# EAGLE schematic JD-T1800 Display Breakout (EAGLE 9.2.2)
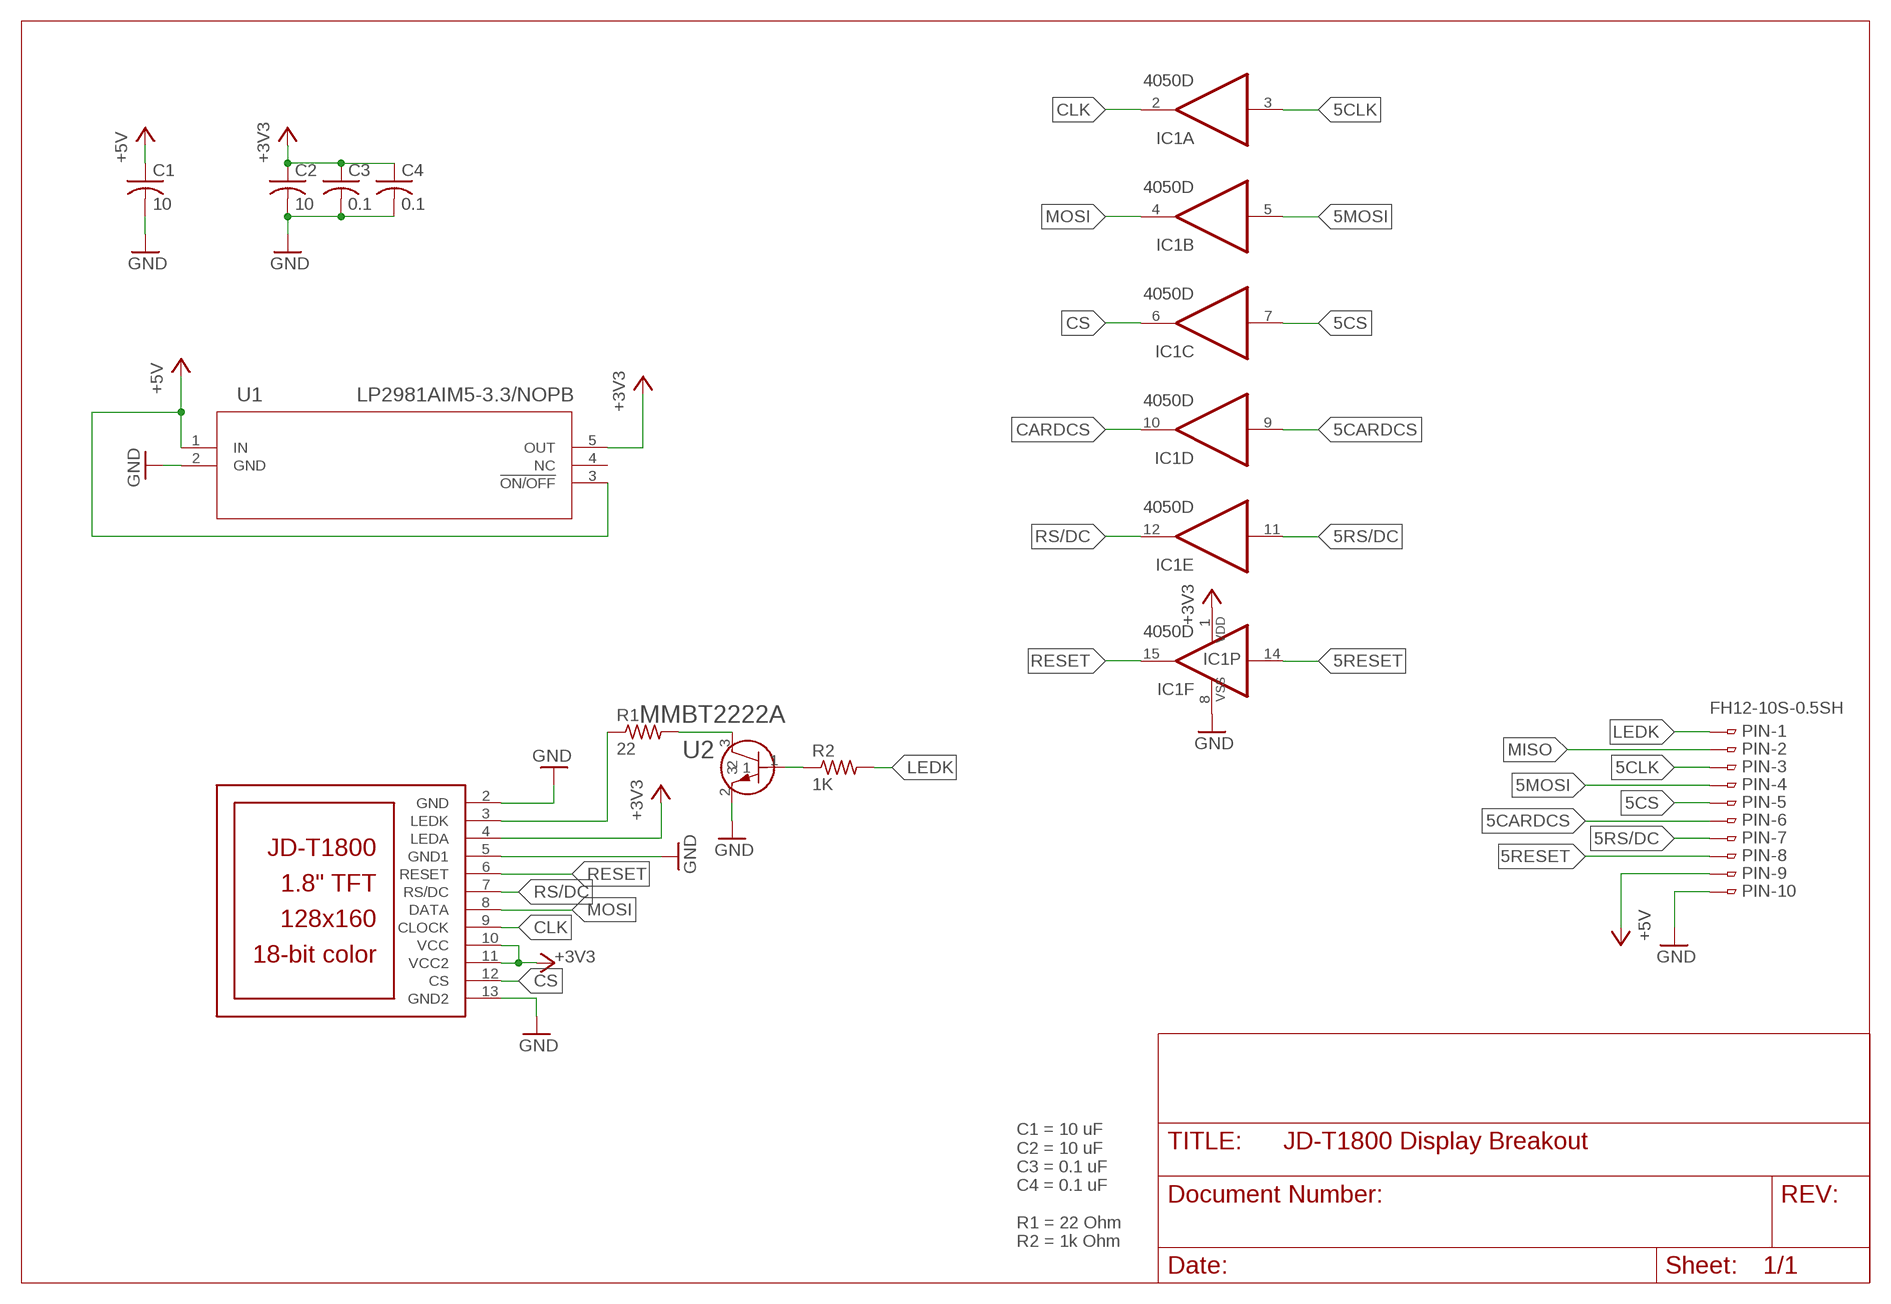
[diagram p0: schematic, sheet 1]

## Parts
C1  10  C-USC0805  [C0805]
C2  10  C-USC0805  [C0805]
C3  0.1  C-USC0805  [C0805]
C4  0.1  C-USC0805  [C0805]
IC1  4050D  [SO16]
PIN  FH12-10S-0.5SH  [FH12-10S-0.5SH]
R1  22  R-US_R0805  [R0805]
R2  1K  R-US_R0805  [R0805]
U1  LP2981AIM5-3.3/NOPB  [MF05A]
U2  MMBT2222A  [SOT23]
U$1  JD-T1800  [JD-T1800]

## Nets
5CARDCS: IC1.9(D:I) PIN.6
5CLK: IC1.3(A:I) PIN.3
5CS: IC1.7(C:I) PIN.5
5MOSI: IC1.5(B:I) PIN.4
5RESET: IC1.14(F:I) PIN.8
5RS/DC: IC1.11(E:I) PIN.7
+3V3: C2.1 C3.1 C4.1 IC1.1(P:VDD) U1.5(OUT) U$1.4(LEDA) U$1.10(VCC) U$1.11(VCC2)
+5V: C1.1 PIN.9 U1.1(IN) U1.3(!ON/OFF)
CARDCS: IC1.10(D:O)
CLK: IC1.2(A:O) U$1.9(CLOCK)
CS: IC1.6(C:O) U$1.12(CS)
GND: C1.2 C2.2 C3.2 C4.2 IC1.8(P:VSS) PIN.10 U1.2(GND) U2.2 U$1.2(GND) U$1.5(GND1) U$1.13(GND2)
LEDK: PIN.1 R2.2
MISO: PIN.2
MOSI: IC1.4(B:O) U$1.8(DATA)
N$1: R1.1 U$1.3(LEDK)
N$2: R1.2 U2.3
N$3: R2.1 U2.1
RESET: IC1.15(F:O) U$1.6(RESET)
RS/DC: IC1.12(E:O) U$1.7(RS/DC)
Unconnected: U1.4(NC)

## Notes on the sheet
- C1 = 10 uF
  C2 = 10 uF
  C3 = 0.1 uF
  C4 = 0.1 uF
  
  R1 = 22 Ohm
  R2 = 1k Ohm

## Library data of the parts
C1-C4 = rcl:C-US: CAPACITOR, American symbol; SPICEPREFIX: C
IC1 = 40xx:4050: Hex non-inverting BUFFER
PIN = con-hirose:FH12-10S-0.5S: 0.5mm Pitch Connectors For FPC/FFC Source: Data sheet <http://www.hirose.co.jp/cataloge_hp/e58605370.pdf>; MPN: FH12-10S-0.5SH(55); OC_FARNELL: 1324540; OC_NEWARK: 34M6152
R1 R2 = resistor:R-US_: RESISTOR, American symbol
U1 = LP2981AIM5-3.3:LP2981AIM5-3.3/NOPB; MANUFACTURER_PART_NUMBER: LP2981AIM53.3NOPB; VENDOR: Texas Instruments
U2 = MMBT2222A:MMBT2222A; MANUFACTURER_PART_NUMBER: MMBT2222A; VENDOR: Nexperia
U$1 = adafruit:JD-T1800